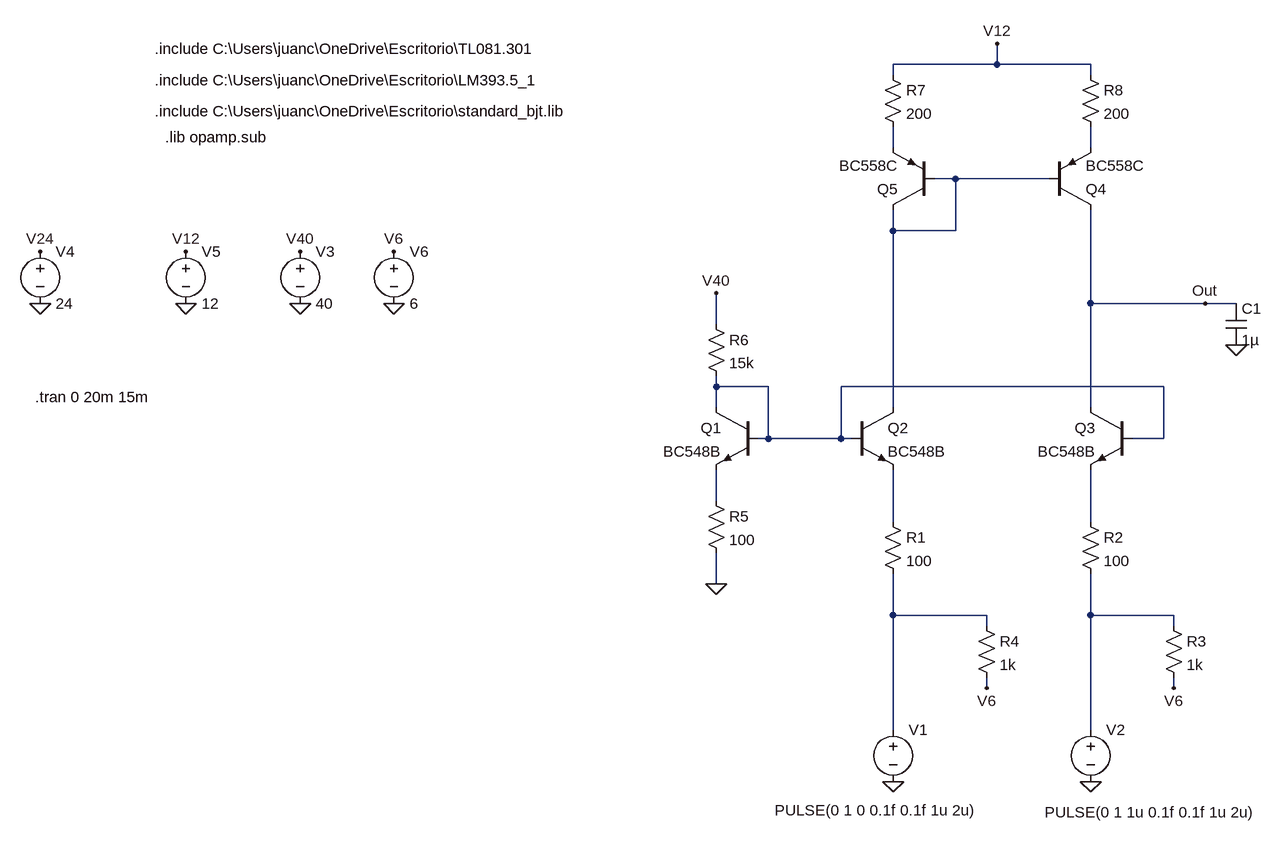
[diagram p0: schematic Fuentes_salida_flipflop_v3_PD.asc]
Fuentes_salida_flipflop_v3_PD.asc, the LTspice schematic file:
Version 4
SHEET 1 1748 1368
WIRE 1296 -160 1296 -192
WIRE 1296 -160 1136 -160
WIRE 1440 -160 1296 -160
WIRE 1136 -144 1136 -160
WIRE 1440 -144 1440 -160
WIRE 1136 -32 1136 -64
WIRE 1440 -32 1440 -64
WIRE 1232 16 1200 16
WIRE 1376 16 1232 16
WIRE 1136 96 1136 64
WIRE 1232 96 1232 16
WIRE 1232 96 1136 96
WIRE 1440 208 1440 64
WIRE 1616 208 1440 208
WIRE 1664 208 1616 208
WIRE 864 240 864 192
WIRE 864 336 864 320
WIRE 944 336 864 336
WIRE 1552 336 1056 336
WIRE 864 368 864 336
WIRE 1136 368 1136 96
WIRE 1440 368 1440 208
WIRE 944 416 944 336
WIRE 944 416 928 416
WIRE 1056 416 1056 336
WIRE 1056 416 944 416
WIRE 1072 416 1056 416
WIRE 1552 416 1552 336
WIRE 1552 416 1504 416
WIRE 864 512 864 464
WIRE 1136 544 1136 464
WIRE 1440 544 1440 464
WIRE 864 640 864 592
WIRE 1136 688 1136 624
WIRE 1280 688 1136 688
WIRE 1440 688 1440 624
WIRE 1568 688 1440 688
WIRE 1280 704 1280 688
WIRE 1568 704 1568 688
WIRE 1280 800 1280 784
WIRE 1568 800 1568 784
WIRE 1136 864 1136 688
WIRE 1440 864 1440 688
FLAG 1440 944 0
FLAG 1136 944 0
FLAG -176 208 0
FLAG -176 128 V24
FLAG 48 208 0
FLAG 48 128 V12
FLAG 864 640 0
FLAG 1568 800 V6
FLAG 1280 800 V6
FLAG 224 208 0
FLAG 368 208 0
FLAG 224 128 V40
FLAG 864 192 V40
FLAG 368 128 V6
FLAG 1664 272 0
FLAG 1296 -192 V12
FLAG 1616 208 Out
SYMBOL voltage 1136 848 R0
WINDOW 123 0 0 Left 0
WINDOW 39 0 0 Left 0
WINDOW 3 -182 140 Left 2
SYMATTR Value PULSE(0 1 0 0.1f 0.1f 1u 2u)
SYMATTR InstName V1
SYMBOL voltage 1440 848 R0
WINDOW 123 0 0 Left 0
WINDOW 39 0 0 Left 0
WINDOW 3 -71 143 Left 2
SYMATTR Value PULSE(0 1 1u 0.1f 0.1f 1u 2u)
SYMATTR InstName V2
SYMBOL voltage -176 112 R0
WINDOW 123 0 0 Left 0
WINDOW 39 0 0 Left 0
SYMATTR InstName V4
SYMATTR Value 24
SYMBOL voltage 48 112 R0
WINDOW 123 0 0 Left 0
WINDOW 39 0 0 Left 0
SYMATTR InstName V5
SYMATTR Value 12
SYMBOL npn 1072 368 R0
SYMATTR InstName Q2
SYMATTR Value BC548B
SYMBOL npn 1504 368 M0
SYMATTR InstName Q3
SYMATTR Value BC548B
SYMBOL res 1120 528 R0
SYMATTR InstName R1
SYMATTR Value 100
SYMBOL res 1424 528 R0
SYMATTR InstName R2
SYMATTR Value 100
SYMBOL res 1552 688 R0
SYMATTR InstName R3
SYMATTR Value 1k
SYMBOL res 1264 688 R0
SYMATTR InstName R4
SYMATTR Value 1k
SYMBOL npn 928 368 M0
SYMATTR InstName Q1
SYMATTR Value BC548B
SYMBOL res 848 496 R0
SYMATTR InstName R5
SYMATTR Value 100
SYMBOL res 848 224 R0
SYMATTR InstName R6
SYMATTR Value 15k
SYMBOL voltage 224 112 R0
WINDOW 123 0 0 Left 0
WINDOW 39 0 0 Left 0
SYMATTR InstName V3
SYMATTR Value 40
SYMBOL voltage 368 112 R0
WINDOW 123 0 0 Left 0
WINDOW 39 0 0 Left 0
SYMATTR InstName V6
SYMATTR Value 6
SYMBOL cap 1648 208 R0
SYMATTR InstName C1
SYMATTR Value 1µ
SYMBOL pnp 1376 64 M180
SYMATTR InstName Q4
SYMATTR Value BC558C
SYMBOL pnp 1200 64 R180
SYMATTR InstName Q5
SYMATTR Value BC558C
SYMBOL res 1120 -160 R0
SYMATTR InstName R7
SYMATTR Value 200
SYMBOL res 1424 -160 R0
SYMATTR InstName R8
SYMATTR Value 200
TEXT -184 352 Left 2 !.tran 0 20m 15m
TEXT 0 -88 Left 2 !.include C:\\Users\\juanc\\OneDrive\\Escritorio\\standard_bjt.lib
TEXT 0 -136 Left 2 !.include C:\\Users\\juanc\\OneDrive\\Escritorio\\LM393.5_1
TEXT 0 -184 Left 2 !.include C:\\Users\\juanc\\OneDrive\\Escritorio\\TL081.301
TEXT 16 -48 Left 2 !.lib opamp.sub

The netlist it stands for:
* Fuentes_salida_flipflop_v3_PD.asc
V1 N008 0 PULSE(0 1 0 0.1f 0.1f 1u 2u)
V2 N009 0 PULSE(0 1 1u 0.1f 0.1f 1u 2u)
V4 V24 0 24
V5 V12 0 12
Q2 N003 N004 N006 0 BC548B
Q3 Out N004 N007 0 BC548B
R1 N006 N008 100
R2 N007 N009 100
R3 N009 V6 1k
R4 N008 V6 1k
Q1 N004 N004 N005 0 BC548B
R5 N005 0 100
R6 V40 N004 15k
V3 V40 0 40
V6 V6 0 6
C1 Out 0 1µ
Q4 Out N003 N002 0 BC558C
Q5 N003 N003 N001 0 BC558C
R7 V12 N001 200
R8 V12 N002 200
.model NPN NPN
.model PNP PNP
.lib standard.bjt
.tran 0 20m 15m
.include C:\Users\juanc\OneDrive\Escritorio\standard_bjt.lib
.include C:\Users\juanc\OneDrive\Escritorio\LM393.5_1
.include C:\Users\juanc\OneDrive\Escritorio\TL081.301
.lib opamp.sub
.backanno
.end